# Altium project Mach_PLC_V1.PrjPcb
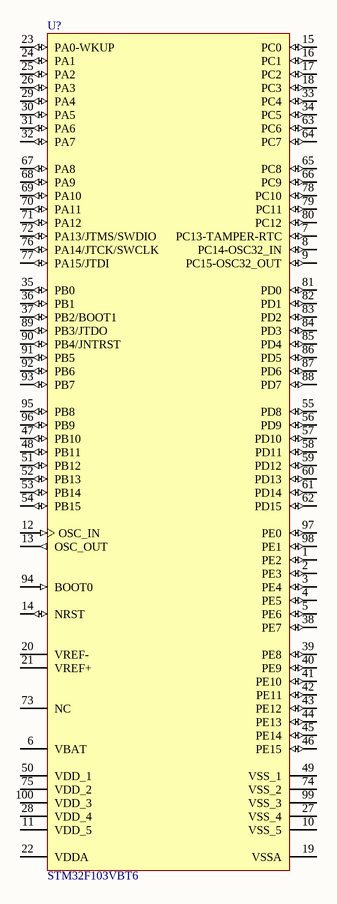
[diagram p0: SCH_Mach_PLC_V1.SchDoc]
1 sheet, 1 parts. Net scope: global (net labels, ports and power ports of the same name join across sheets).
Board file: PCB1_Mach_PLC_V1.PcbDoc

## Sheet SCH_Mach_PLC_V1.SchDoc
size A4; Organization: THIÊN PHÚC MOBILE; Address1: 15/12/42 - Đường Số 8; Address2: Phường 11 - Gò Vấp - HCM; Address3: LH: 0909777563; Address4: www.tpmobilelaptop.com

### Parts
U?  STM32F103VBT6  [TQFP100L]

### Nets

Not connected (* = marked no-connect by the designer): U? 1(PE2) 2(PE3) 3(PE4) 4(PE5) 5(PE6) 6(VBAT) 7(PC13-TAMPER-RTC) 8(PC14-OSC32_IN) 9(PC15-OSC32_OUT) 10(VSS_5) 11(VDD_5) 12(OSC_IN) 13(OSC_OUT) 14(NRST) 15(PC0) 16(PC1) 17(PC2) 18(PC3) 19(VSSA) 20(VREF-) 21(VREF+) 22(VDDA) 23(PA0-WKUP) 24(PA1) 25(PA2) 26(PA3) 27(VSS_4) 28(VDD_4) 29(PA4) 30(PA5) 31(PA6) 32(PA7) 33(PC4) 34(PC5) 35(PB0) 36(PB1) 37(PB2/BOOT1) 38(PE7) 39(PE8) 40(PE9) 41(PE10) 42(PE11) 43(PE12) 44(PE13) 45(PE14) 46(PE15) 47(PB10) 48(PB11) 49(VSS_1) 50(VDD_1) 51(PB12) 52(PB13) 53(PB14) 54(PB15) 55(PD8) 56(PD9) 57(PD10) 58(PD11) 59(PD12) 60(PD13) 61(PD14) 62(PD15) 63(PC6) 64(PC7) 65(PC8) 66(PC9) 67(PA8) 68(PA9) 69(PA10) 70(PA11) 71(PA12) 72(PA13/JTMS/SWDIO) 73(NC) 74(VSS_2) 75(VDD_2) 76(PA14/JTCK/SWCLK) 77(PA15/JTDI) 78(PC10) 79(PC11) 80(PC12) 81(PD0) 82(PD1) 83(PD2) 84(PD3) 85(PD4) 86(PD5) 87(PD6) 88(PD7) 89(PB3/JTDO) 90(PB4/JNTRST) 91(PB5) 92(PB6) 93(PB7) 94(BOOT0) 95(PB8) 96(PB9) 97(PE0) 98(PE1) 99(VSS_3) 100(VDD_3)

### Notes on the sheet
- Title
- Size:
- Date:
- A4
- Number:
- Time:
- Revision:
- Sheet :
- of
- File:

### Library data of the parts
U? = STM32F103VBT6: STM32 ARM-based 32-bit MCU with 64 Kbytes Flash, 100-pin LQFP, Industrial Temperature; Published: 30-May-2008; DatasheetVersion: rev6, Mar-2008; PackageVersion: Mar-2008; PackageReference: LQFP100; Publisher: Altium Limited; PackageDescription: 100-Pin Low-Profile Quad Flat Pack, 14 x 14 mm Body, 0.5 mm Pitch (LQFP100); ComponentLink1Description: Manufacturer Link; ComponentLink1URL: www.st.com/stm32; ComponentLink2Description: Datasheet; ComponentLink2URL: http://www.st.com/stonline/products/literature/ds/13587.pdf